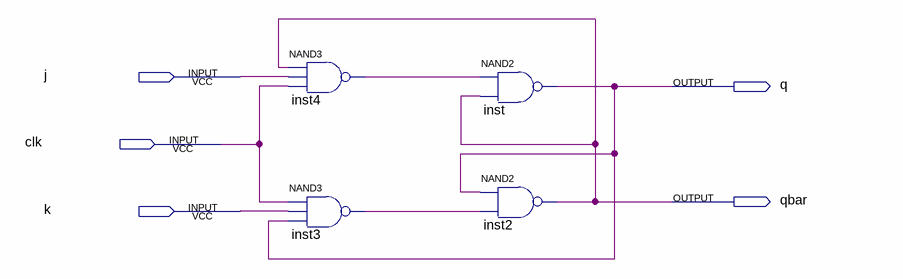
[diagram p0: schematic sheet]
// Quartus schematic jkff_a.bdf as structural Verilog: 4 symbols, 5 pins
module jkff_a (
  input  j,
  input  clk,
  input  k,
  output q,
  output qbar
);

  wire inst3_out, inst4_out;

  nand inst4 (inst4_out, qbar, j, clk);
  nand inst3 (inst3_out, clk, k, q);
  nand inst (q, inst4_out, qbar);
  nand inst2 (qbar, q, inst3_out);
endmodule
